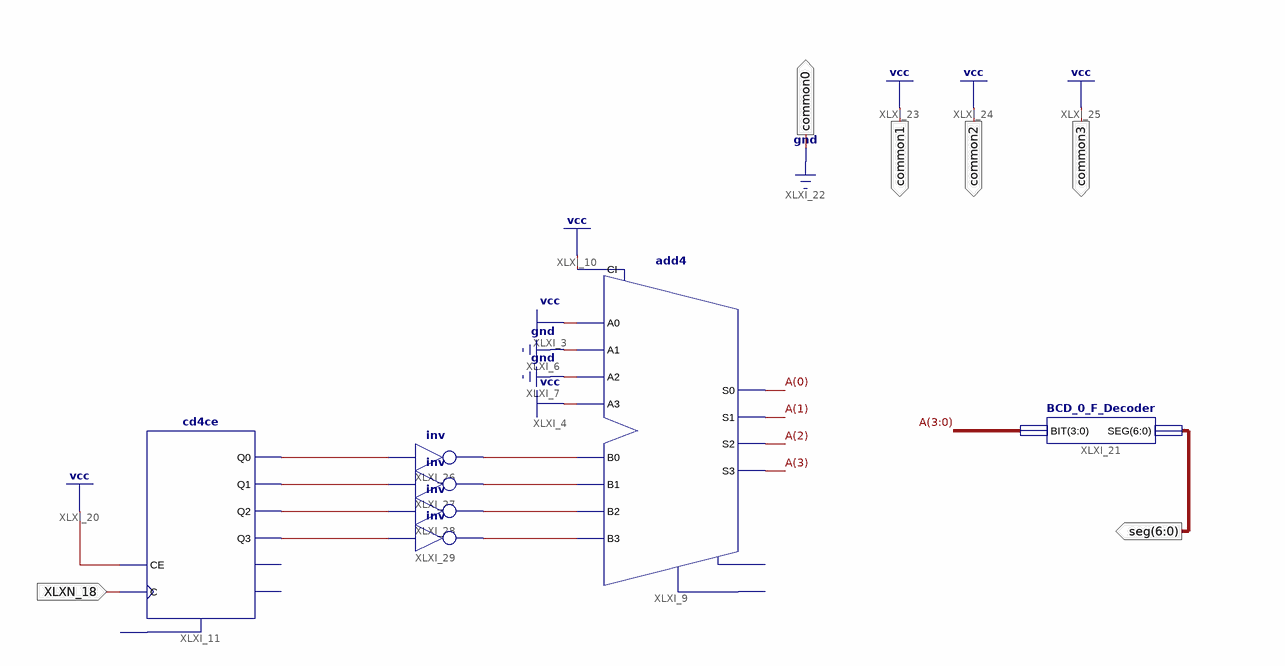
[diagram p0: schematic sheet 1]
// Xilinx ISE schematic main.sch (spartan6) as structural Verilog: 7 symbols, 6 ports
module main (
  input  XLXN_18,
  output [6:0] seg,
  output common0,
  output common1,
  output common2,
  output common3
);

  wire XLXN_29, XLXN_30, XLXN_31, XLXN_32, XLXN_33, XLXN_34, XLXN_35, XLXN_36;
  wire [3:0] A;

  cd4ce XLXI_11 (.C(XLXN_18), .CE(1'b1), .Q0(XLXN_29), .Q1(XLXN_30), .Q2(XLXN_31), .Q3(XLXN_32));  // open: CLR, CEO, TC
  add4 XLXI_9 (
    .A0(1'b1), .A1(1'b0), .A2(1'b0), .A3(1'b1), .B0(XLXN_33), .B1(XLXN_34), .B2(XLXN_35), .B3(XLXN_36),
    .CI(1'b1), .S0(A[0]), .S1(A[1]), .S2(A[2]), .S3(A[3]));  // open: CO, OFL
  BCD_0_F_Decoder XLXI_21 (.BIT(A), .SEG(seg));
  not XLXI_26 (XLXN_33, XLXN_29);
  not XLXI_27 (XLXN_34, XLXN_30);
  not XLXI_28 (XLXN_35, XLXN_31);
  not XLXI_29 (XLXN_36, XLXN_32);

  assign common0 = 1'b0;
  assign common1 = 1'b1;
  assign common2 = 1'b1;
  assign common3 = 1'b1;

  // Notes on the sheet:
  //   LOC on signal XLXN_18 = P45
  //   CLOCK_DEDICATED_ROUTE on signal XLXN_18 = TRUE
endmodule
